# Altium schematic sheet BLOCK DIAGRAM.SchDoc
size A3; ApprovedBy: Enes Mercan; CompanyName: HurSAT; Engineer: Enes Mercan; SheetNumber: 2; SheetTotal: 5; PageSetup: Record=PageOptions|CenterHorizontal=True|CenterVertical=True|PrintScale=0.52|XCorrection=1.00|YCorrection=1.00|PrintKind=1|BorderSize=5000000|LeftOffset=0|BottomOffset=0|Orientation=2|PaperLength=1000|PaperWidth=1000|Scale=100|PaperSource=4|PrintQuality=600|MediaType=1|DitherType=10|PrintScaleMode=1|PaperKind=A4|PaperIndex=9; PageSize: A3
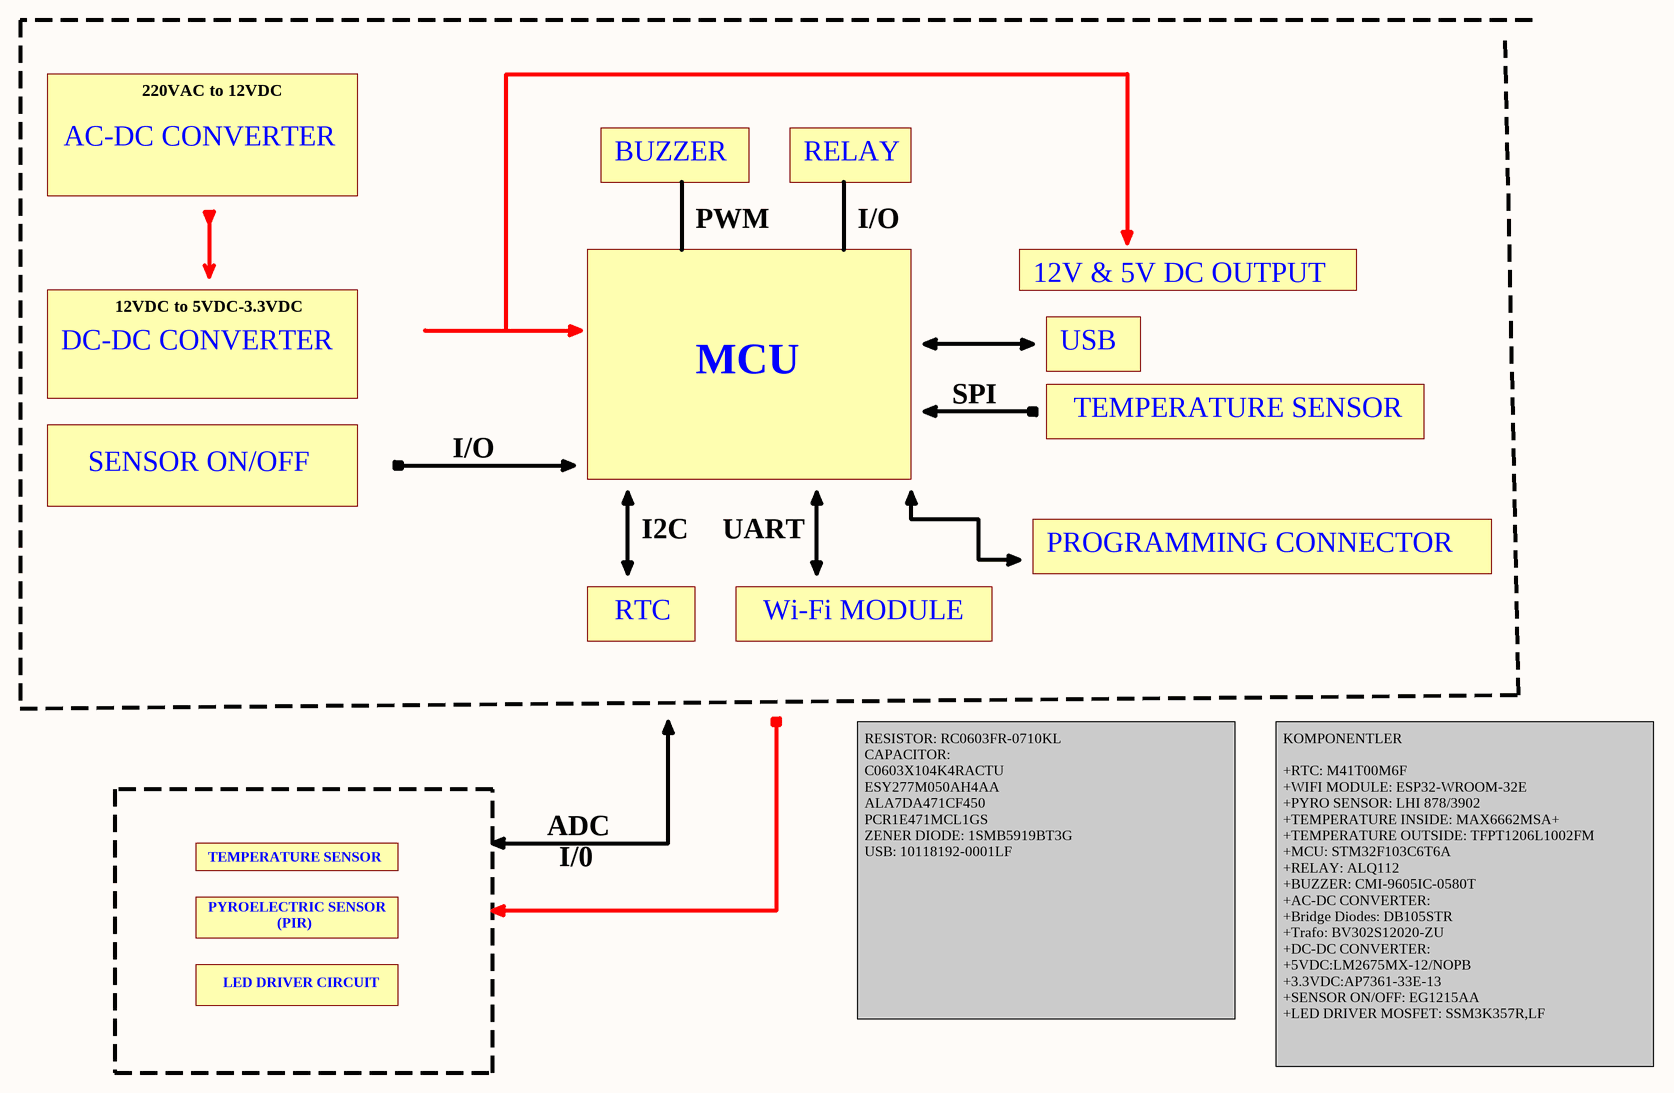
[diagram p0: BLOCK DIAGRAM.SchDoc]

## Notes on the sheet
- AC-DC CONVERTER
- 220VAC to 12VDC
- BUZZER
- RELAY
- PWM
- I/O
- 12V & 5V DC OUTPUT
- DC-DC CONVERTER
- 12VDC to 5VDC-3.3VDC
- USB
- MCU
- SPI
- TEMPERATURE SENSOR
- SENSOR ON/OFF
- I2C
- UART
- PROGRAMMING CONNECTOR
- RTC
- Wi-Fi MODULE
- ADC
- I/0
- PYROELECTRIC SENSOR
- (PIR)
- LED DRIVER CIRCUIT
- RESISTOR: RC0603FR-0710KL
  CAPACITOR:
  C0603X104K4RACTU
  ESY277M050AH4AA
  ALA7DA471CF450
  PCR1E471MCL1GS
  ZENER DIODE: 1SMB5919BT3G
  USB: 10118192-0001LF
- KOMPONENTLER
  +RTC: M41T00M6F
  +WIFI MODULE: ESP32-WROOM-32E
  +PYRO SENSOR: LHI 878/3902
  +TEMPERATURE INSIDE: MAX6662MSA+
  +TEMPERATURE OUTSIDE: TFPT1206L1002FM
  +MCU: STM32F103C6T6A
  +RELAY: ALQ112
  +BUZZER: CMI-9605IC-0580T
  +AC-DC CONVERTER:
  +Bridge Diodes: DB105STR
  +Trafo: BV302S12020-ZU
  +DC-DC CONVERTER:
  +5VDC:LM2675MX-12/NOPB
  +3.3VDC:AP7361-33E-13
  +SENSOR ON/OFF: EG1215AA
  +LED DRIVER MOSFET: SSM3K357R,LF
- (Block Diagram)
- ~
- Designed By:
- Page Name:
- Title:
- Variant:
- Page Size:
- Company:
- ApprovedBy:
- Date:
- Sheet:
- Revision:
- of